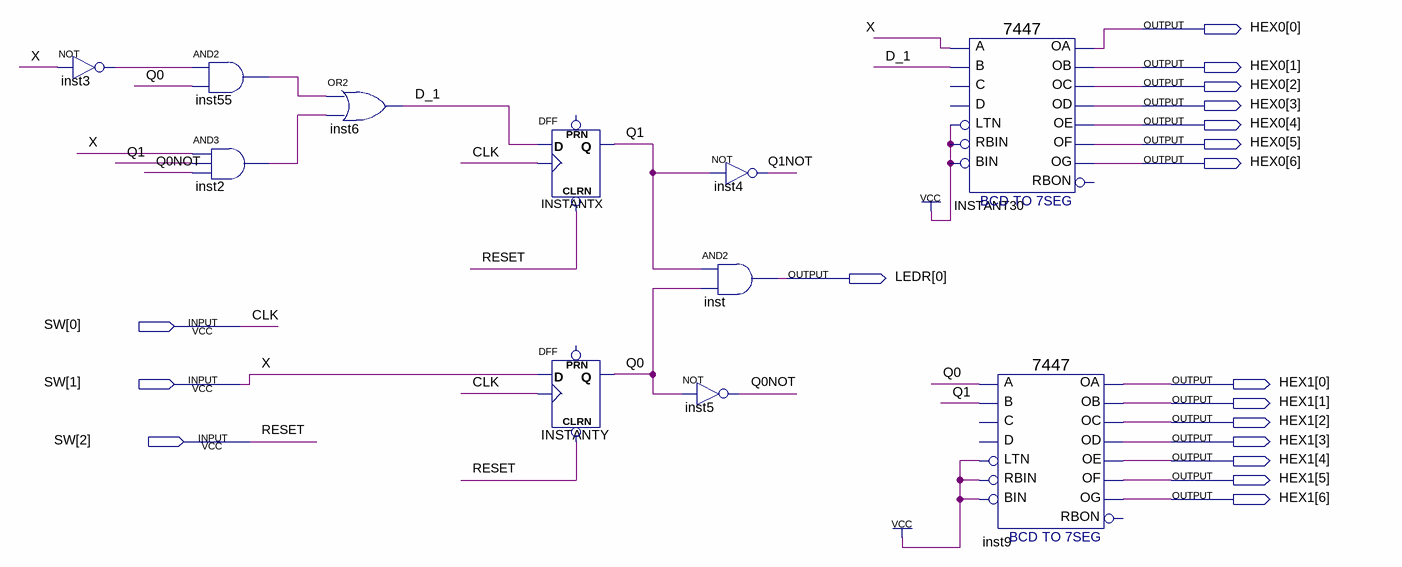
[diagram p0: schematic sheet]
// Quartus schematic FSM.bdf as structural Verilog: 11 symbols, 18 pins
module FSM (
  input  [2:0] SW,
  output [6:0] HEX0,
  output [0:0] LEDR,
  output [6:0] HEX1
);

  wire D_1, inst2_out, inst3_out, inst55_out, Q0, Q0NOT, Q1, Q1NOT;

  not inst3 (inst3_out, SW[1]);
  and inst55 (inst55_out, inst3_out, Q0);
  and inst2 (inst2_out, SW[1], Q1, Q0NOT);
  or inst6 (D_1, inst55_out, inst2_out);
  DFF INSTANTX (.CLRN(SW[2]), .CLK(SW[0]), .D(D_1), .Q(Q1));  // open: PRN
  DFF INSTANTY (.CLRN(SW[2]), .CLK(SW[0]), .D(SW[1]), .Q(Q0));  // open: PRN
  not inst4 (Q1NOT, Q1);
  and inst (LEDR[0], Q1, Q0);
  not inst5 (Q0NOT, Q0);
  \7447  INSTANT30 (
    .LTN(1'b1), .B(D_1), .RBIN(1'b1), .BIN(1'b1), .A(SW[1]), .OB(HEX0[1]), .OC(HEX0[2]), .OE(HEX0[4]),
    .OD(HEX0[3]), .OF(HEX0[5]), .OG(HEX0[6]), .OA(HEX0[0]));  // open: C, D, RBON
  \7447  inst9 (
    .LTN(1'b1), .B(Q1), .RBIN(1'b1), .BIN(1'b1), .A(Q0), .OB(HEX1[1]), .OC(HEX1[2]), .OE(HEX1[4]),
    .OD(HEX1[3]), .OF(HEX1[5]), .OG(HEX1[6]), .OA(HEX1[0]));  // open: C, D, RBON

  // Other names for the same wires on the sheet: CLK = SW[0]; RESET = SW[2]; X = SW[1]
endmodule
